# EasyEDA Pro project ProProject_2024电赛备赛清单_Wang01_2024-08-05.epro, schematic Schematic2
Create Date: 2024-07-20; Page Name: P1; Project Name: 2024电赛备赛清单_Wang01; Schematic Name: Schematic2; Update Date: 2024-07-22; Company: 嘉立创EDA; Page Size: A4; Version: V1.0
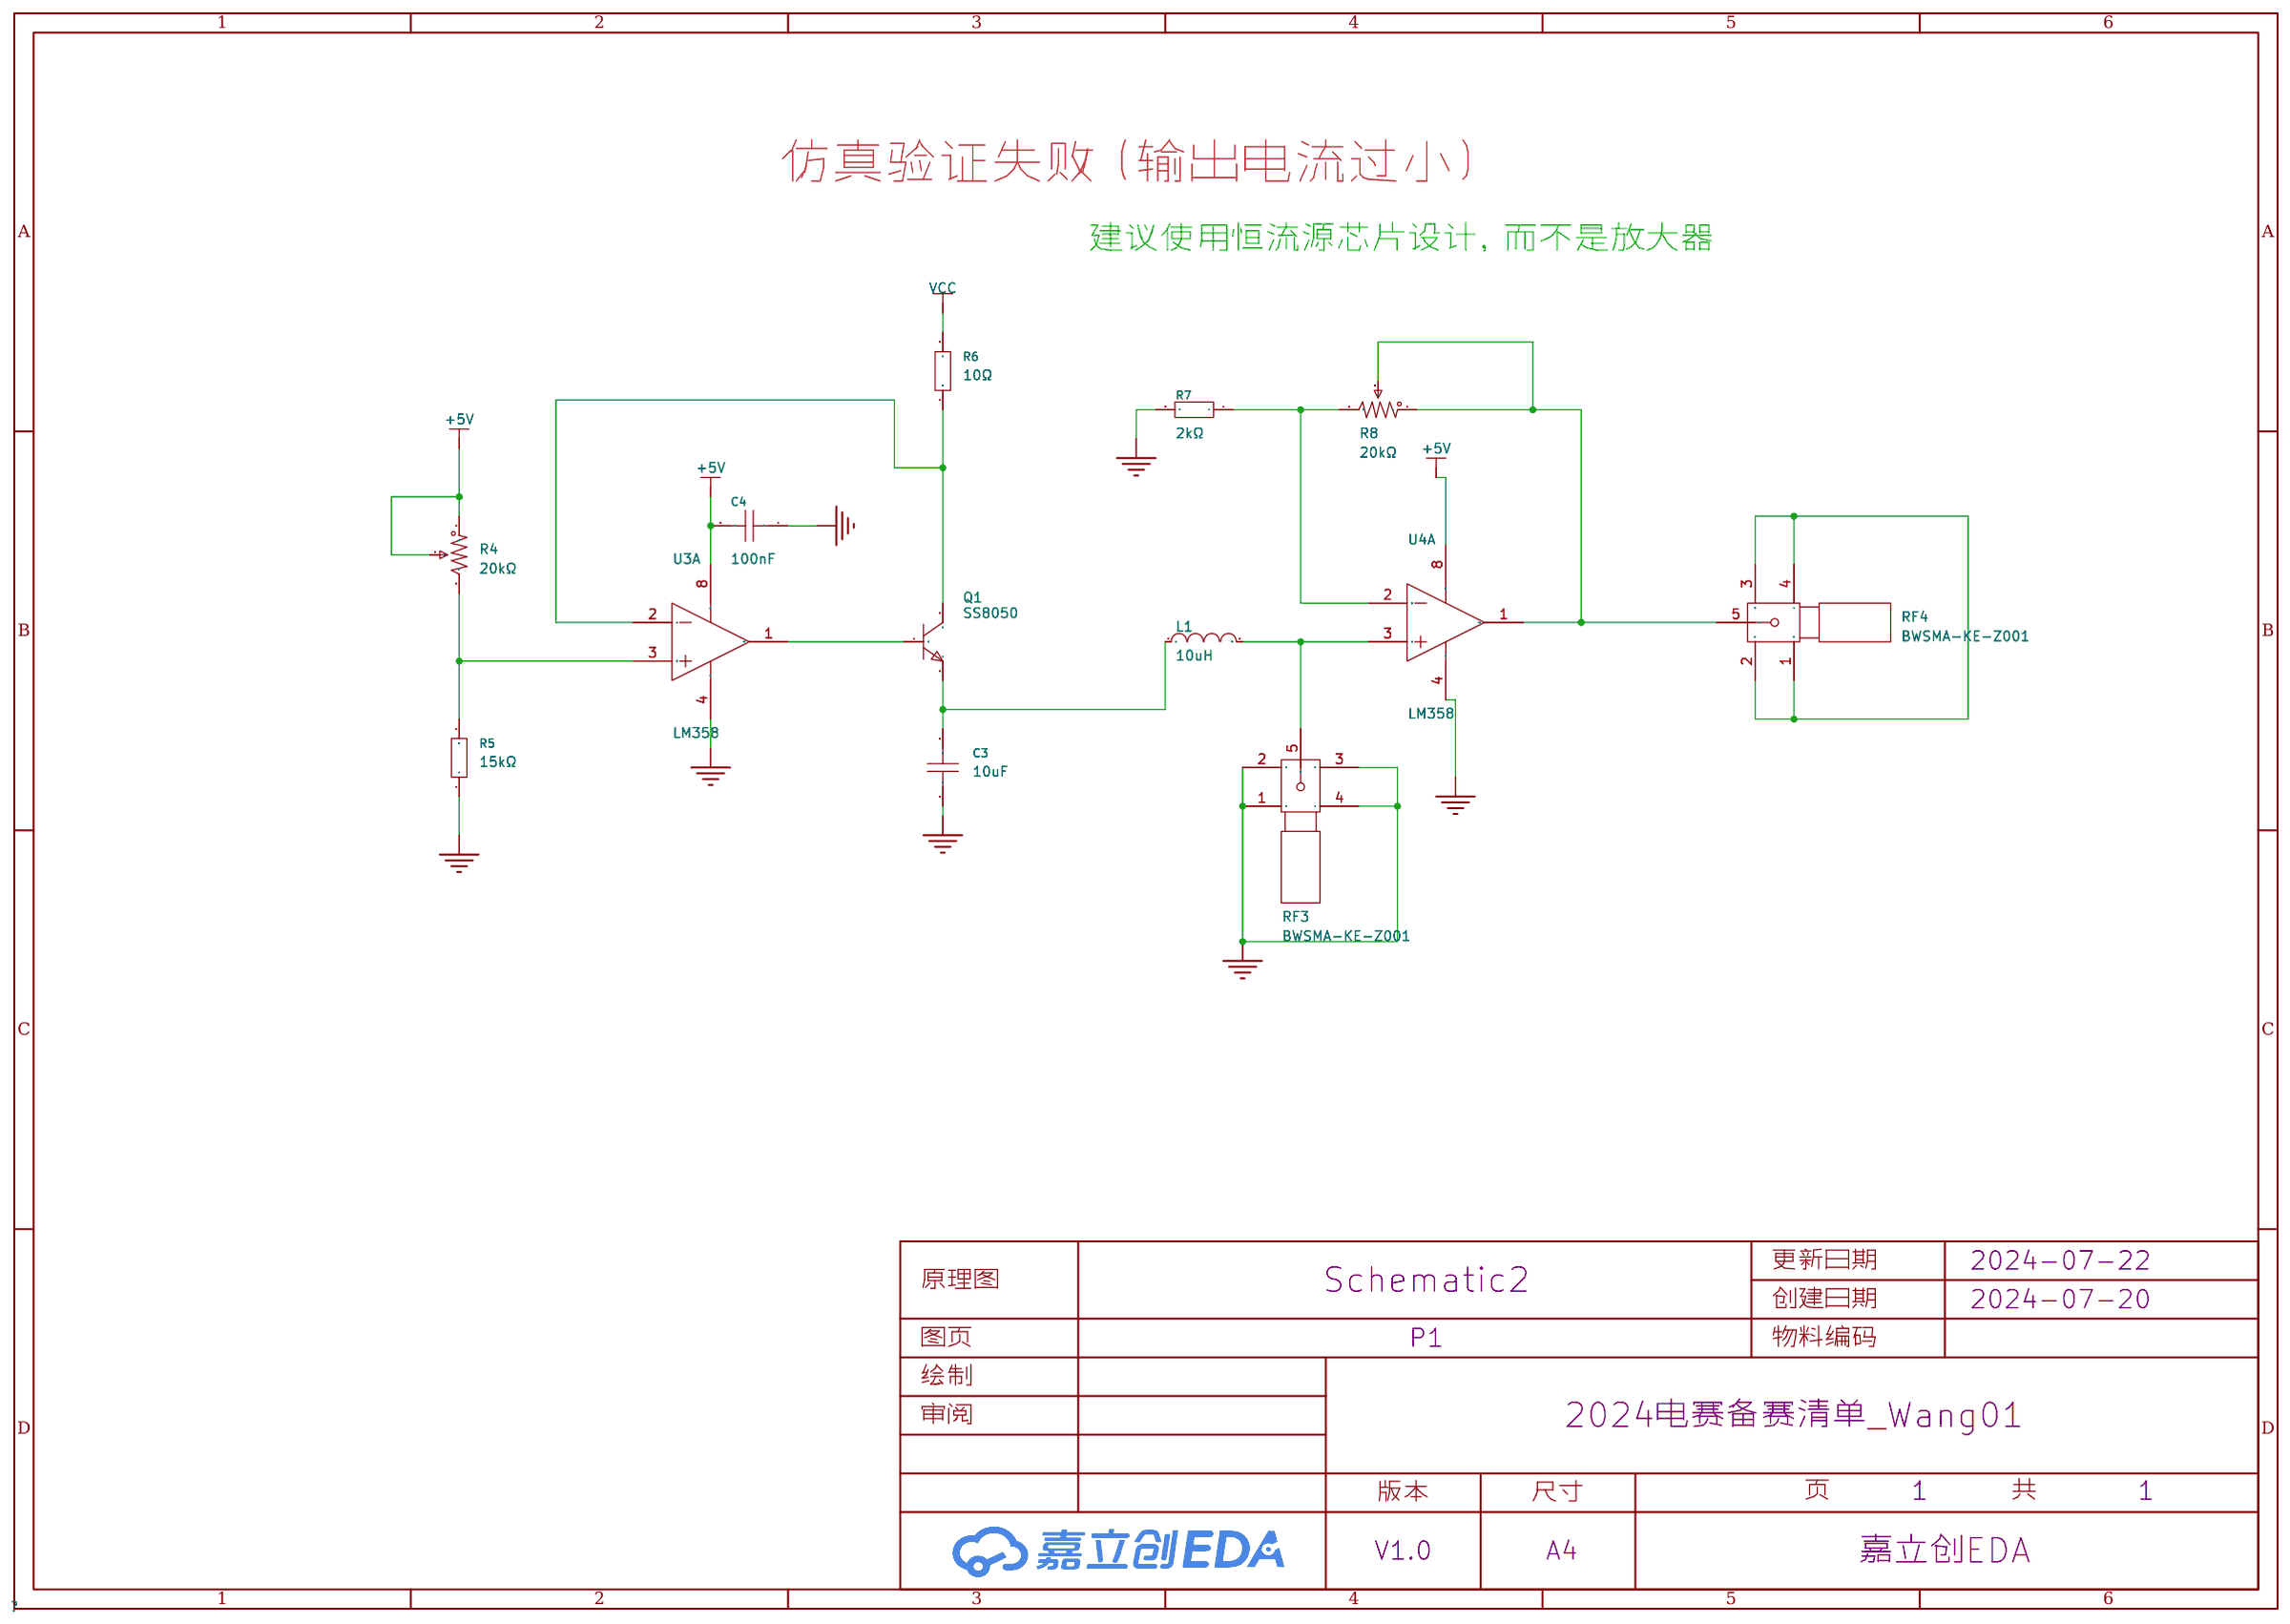
[diagram p4: schematic sheet]

## Parts
C3  10uF  [CAP-TH_L5.5-W5.0-P5.00-D0.6]
C4  100nF  [CAP-TH_L5.5-W5.0-P5.00-D0.6]
L1  10uH  [IND-SMD_L5.4-W5.2_FXL0530]
Q1  SS8050  [SOT-23-3_L2.9-W1.3-P1.90-LS2.4-BR]
R4  20kΩ  [RES-ADJ-TH_3P-L10.0-W10.0-P2.50-L]
R5  15kΩ  [R0603]
R6  10Ω  [R0603]
R7  2kΩ  [R0603]
R8  20kΩ  [RES-ADJ-TH_3P-L10.0-W10.0-P2.50-L]
RF3  BWSMA-KE-Z001  [SMA-TH_BWSMA-KE-Z001]
RF4  BWSMA-KE-Z001  [SMA-TH_BWSMA-KE-Z001]
U3  LM358  [SOP-8_L4.9-W3.9-P1.27-LS6.0-BL]  (section 1)
U4  LM358  [SOP-8_L4.9-W3.9-P1.27-LS6.0-BL]  (section 1)

## Library data of the parts
C3 C4 = CK45-B3AD681KYVRA: 容值:680pF;精度:±10%;额定电压:1kV;温度系数:-;; LCSC Part Name: 680pF ±10% 1kV; Supplier Part: C531432; Manufacturer: TDK; Supplier Footprint: 插件,P=5mm; Datasheet: https://atta.szlcsc.com/upload/public/pdf/source/20220809/DCD8522C4E8CA9369C289C4A09588C25.pdf; Supplier: LCSC; Tolerance: ±10%; Voltage Rated: 1kV
L1 = FXL0530-4R7-M: 电感值:4.7uH;精度:±20%;额定电流:4.5A;饱和电流(Isat):5A;; LCSC Part Name: 4.7uH ±20% 4.5A 50mΩ; Supplier Part: C177246; Manufacturer: cjiang(长江微电); Supplier Footprint: SMD,5.2x5.4mm; Datasheet: https://atta.szlcsc.com/upload/public/pdf/source/20190322/C177246_D81D0671B72FD9DE4B58607F480A6AE0.pdf; Supplier: LCSC; Tolerance: ±20%; Rated Current: 4.5A; Saturation Current (Isat): 5A; DC Resistance (DCR): 50mΩ
Q1 = SS8050_C2150: 晶体管类型:NPN;集射极击穿电压(Vceo):25V;集电极电流(Ic):1.5A;功率(Pd):300mW;直流电流增益(hFE@Ic,Vce):200@100mA,1V;; LCSC Part Name: NPN 25V 1.5A Y1 200-350; Supplier Part: C2150; Manufacturer: CJ(江苏长电/长晶); Supplier Footprint: SOT-23; JLCPCB Part Class: 基础库; Datasheet: https://atta.szlcsc.com/upload/public/pdf/source/20230322/AEE86F4B043774EFF80CAEA14A37D9E9.pdf; Supplier: LCSC; Transistor Type: NPN; Collector-Emitter Breakdown Voltage (Vceo): 25V; Collector Current (Ic): 1.5A; Power Dissipation (Pd): 300mW; Collector Cut-Off Current (Icbo): 100nA; Collector-Emitter Saturation Voltage (VCE(sat)@Ic,Ib): 500mV@800mA,80mA; DC Current Gain (hFE@Ic,Vce): 200@100mA,1V; Transition Frequency (fT): 100MHz; Operating Temperature: +150℃@(Tj)
R4 R8 = 3296W-1-103: 阻值:10kΩ;精度:±10%;; LCSC Part Name: 10kΩ ±10%; Supplier Part: C118954; Manufacturer: BOCHEN(博晨); Supplier Footprint: 插件; Datasheet: https://atta.szlcsc.com/upload/public/pdf/source/20171114/C118954_15106326646611117443.pdf; Supplier: LCSC; Tolerance: ±10%
R5-R7 = 0603WAF3301T5E: 电阻类型:厚膜电阻;阻值:3.3kΩ;精度:±1%;功率:100mW;温度系数:±100ppm/℃;; LCSC Part Name: 厚膜电阻 3.3kΩ ±1% 100mW; Supplier Part: C22978; Manufacturer: UNI-ROYAL(厚声); Supplier Footprint: 0603; Datasheet: https://atta.szlcsc.com/upload/public/pdf/source/20200306/C422600_1E6D84923E4A46A82E41ADD87F860B5C.pdf; Supplier: LCSC; Type: 厚膜电阻; Tolerance: ±1%; Power(Watts): 100mW; Temperature Coefficient: ±100ppm/℃; Overload Voltage (Max): 75V; Operating Temperature Range: -55℃~+155℃
RF3 RF4 = BWSMA-KE-Z001_C496549: 连接器类型:板端;射频系列:SMA;接口类型:内孔;端口数量:1;阻抗:50Ω;频率-最大值:12.4GHz;样式:正脚;接口直径:-;接口长度/高度:-;工作温度范围:-65℃~+165℃;; LCSC Part Name: SMA 内孔 正脚 SMA直头正脚板端座子; Supplier Part: C496549; Manufacturer: BAT WIRELESS(蝙蝠无线); Supplier Footprint: 插件; Datasheet: https://atta.szlcsc.com/upload/public/pdf/source/20200416/C496549_767995352B6C9E98F20D658FDC70347F.pdf; Supplier: LCSC; Connector Type: 板端; RF Series: SMA; Interface Type: 内孔; Number of Ports: 1; Impedance: 50Ω; Frequency-Max: 12.4GHz; Style: 正脚; Operating Temperature Range: -65℃~+165℃
U3 U4 = LM358_C5252902: 放大器组数:2;输入失调电压(Vos):5mV;增益带宽积(GBP):1.2MHz;; LCSC Part Name: 增益带宽(GBP):1.2MHz VIO:5mV  LM358; Supplier Part: C5252902; Manufacturer: MSKSEMI(美森科); Supplier Footprint: SOP-8; Datasheet: https://atta.szlcsc.com/upload/public/pdf/source/20221111/EFA130B3B4599AE68A453AC9B85C4BC9.pdf; Supplier: LCSC; Number of Circuits: 2; Voltage - Input Offset(Vos): 5mV; Gain Bandwidth Product(GBP): 1.2MHz

## Nets
+5V: C4.2 R4.1 R4.2 U3.8(VCC) U4.8(VCC)
GND: C3.1 C4.1 R5.1 R7.2 RF3.1 RF3.2 RF3.3 RF3.4 U3.4(VEE) U4.4(VEE)
VCC: R6.2
$1N755: R4.3 R5.2 U3.3(IN1+)
$1N765: L1.2 RF3.5 U4.3(IN1+)
$1N766: R7.1 R8.3 U4.2(IN1-)
$1N768: C3.2 L1.1 Q1.2(E)
$1N770: Q1.1(B) U3.1(OUT1)
$1N771: Q1.3(C) R6.1 U3.2(IN1-)
$1N772: R8.1 R8.2 RF4.5 U4.1(OUT1)
$1N773: RF4.1 RF4.2 RF4.3 RF4.4

## Notes on the sheet
- 仿真验证失败（输出电流过小）
- 建议使用恒流源芯片设计，而不是放大器
